# EAGLE schematic AquariumComputer (EAGLE 9.6.2)
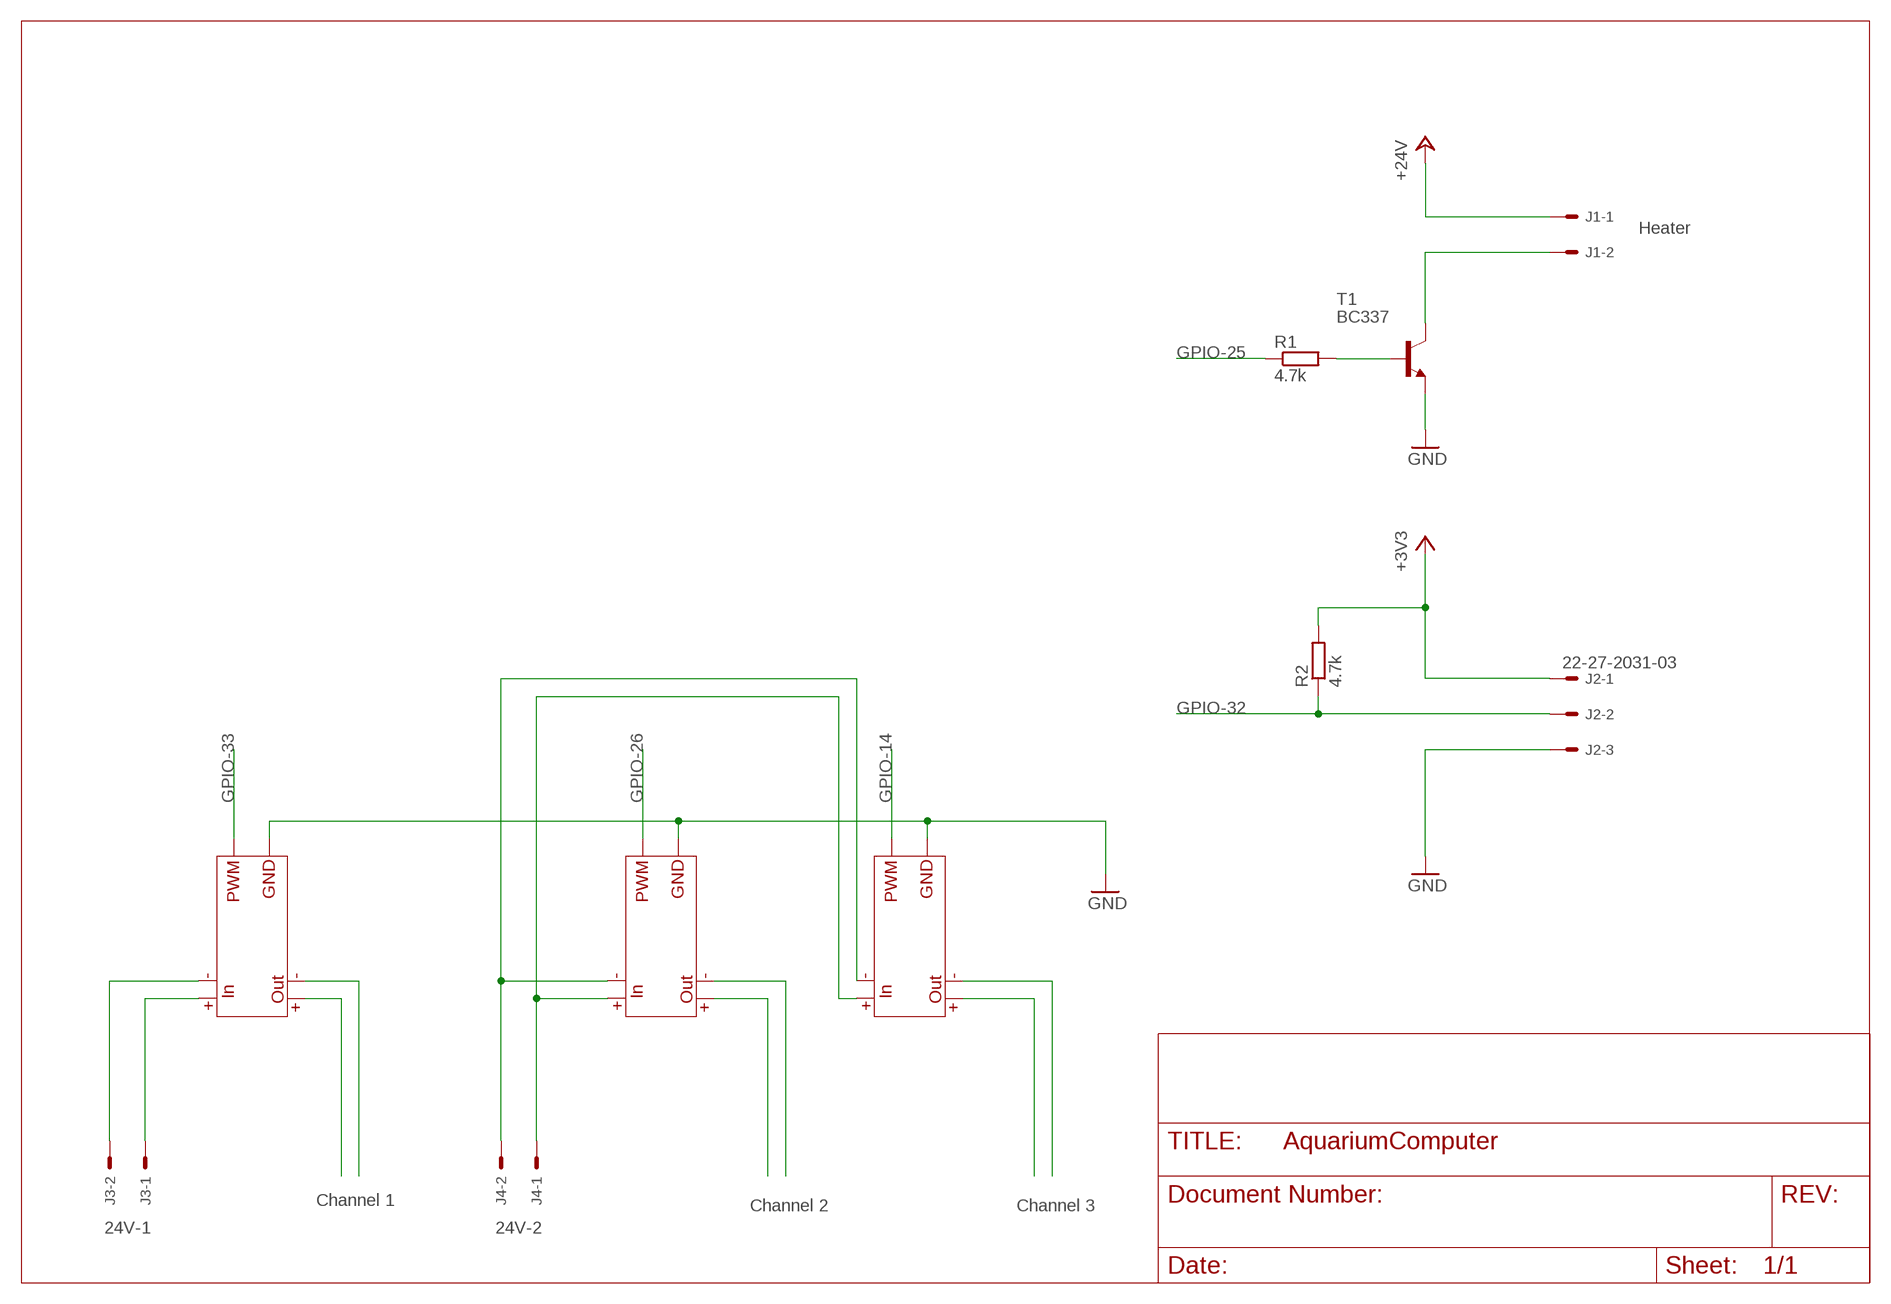
[diagram p0: schematic, sheet 1]

## Parts
J1  22-05-7028-02  [7395-02]
J2  22-27-2031-03  [6410-03]
J3  24V-1  22-05-7028-02  [7395-02]
J4  24V-2  22-05-7028-02  [7395-02]
R1  4.7k  R-EU_0207/12  [0207/12]
R2  4.7k  R-EU_0207/12  [0207/12]
T1  BC337  [TO92]

## Nets
+3V3: J2.1 R2.2
+24V: J1.1
GND: J2.3 T1.1(E)
GPIO-25: R1.1
GPIO-32: J2.2 R2.1
N$1: J1.2 T1.3(C)
N$2: R1.2 T1.2(B)
N$9: J3.1
N$10: J3.2
N$11: J4.1
N$12: J4.2

## Notes on the sheet
- Heater
- PWM | GND | PWM | GND | PWM | GND
- - | - | - | - | - | -
- In | In | In
- Out | Out | Out
- + | + | + | + | + | +
- Channel 1
- Channel 2 | Channel 3

## Library data of the parts
J1 J3 J4 = con-molex:22-?-02: CONNECTOR wire to board 2.54 mm (.1 inch) pitch header; MF: MOLEX; OC_FARNELL: 9731601; OC_NEWARK: unknown
J2 = con-molex:22-?-03: CONNECTOR wire to board 2.54 mm (.1 inch) pitch header; MF: MOLEX; OC_FARNELL: unknown; OC_NEWARK: unknown
R1 R2 = rcl:R-EU_: RESISTOR, European symbol; SPICEPREFIX: R
T1 = transistor:BC337: NPN TRANSISTOR